# Altium schematic sheet Sheet1.SchDoc: The schematic of Tube Board of XDM-1
size A4; Author: ALU; DrawnBy: alu; Engineer: alu; Revision: 1; SheetNumber: 1; SheetTotal: 1; Time: NoTime